# Altium schematic sheet Motor.SchDoc
size A4
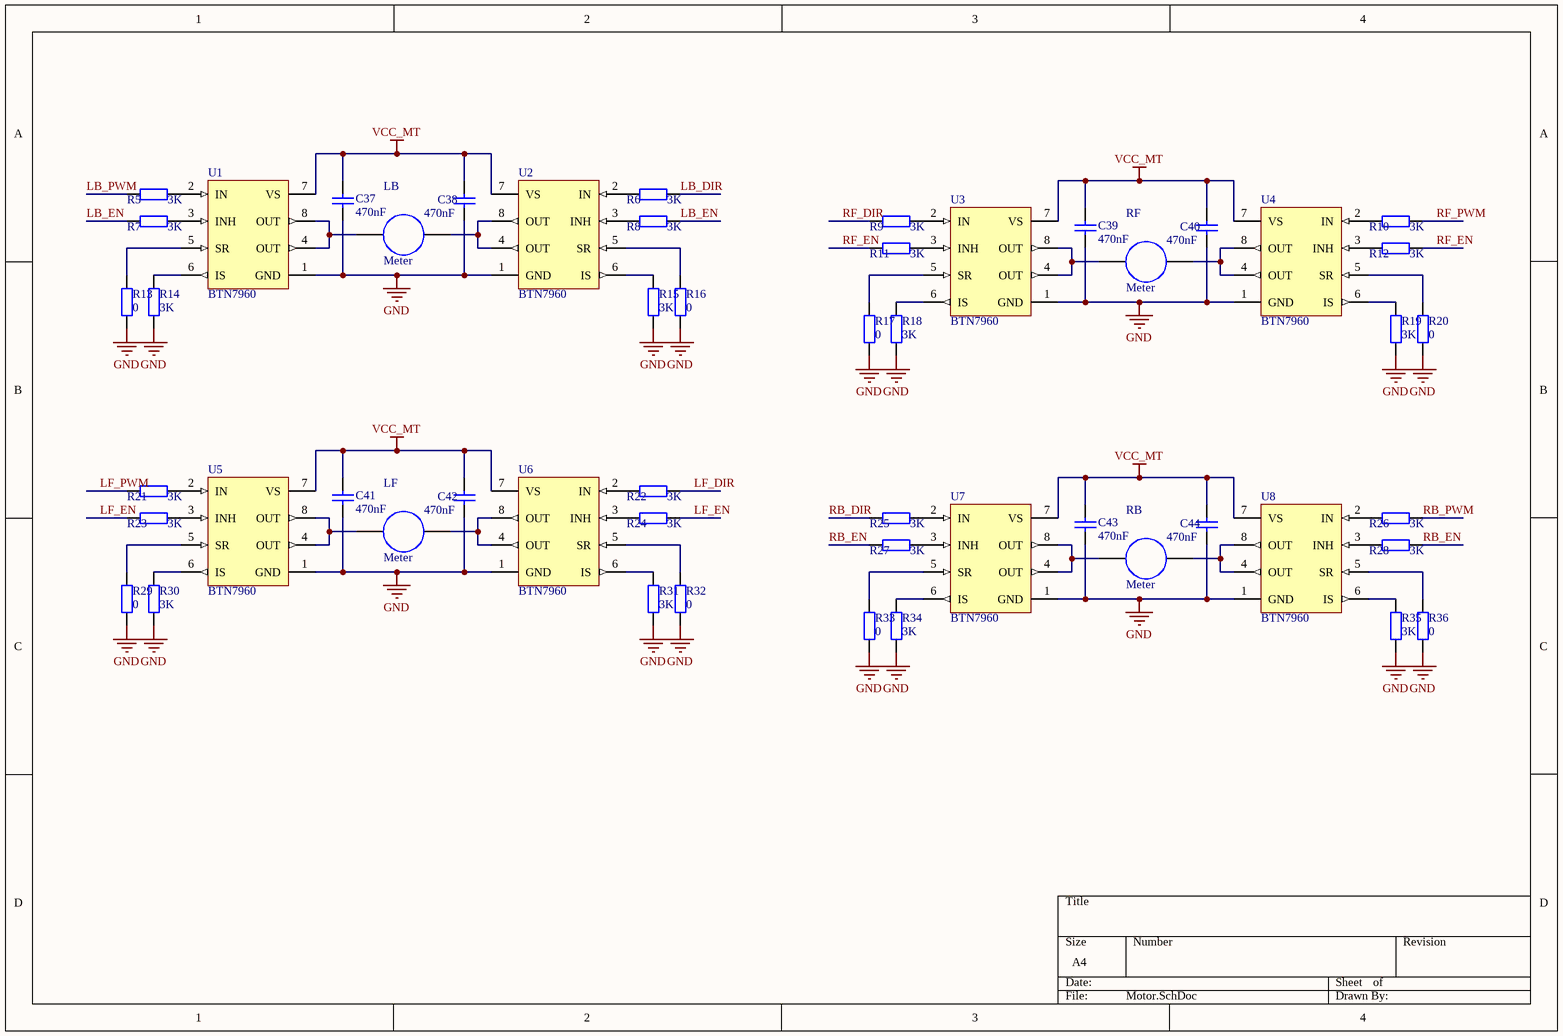
[diagram p0: Motor.SchDoc]

## Parts
C37  value 470nF  [0805_C]  (hidden comment: Cap)
C38  value 470nF  [0805_C]  (hidden comment: Cap)
C39  value 470nF  [0805_C]  (hidden comment: Cap)
C40  value 470nF  [0805_C]  (hidden comment: Cap)
C41  value 470nF  [0805_C]  (hidden comment: Cap)
C42  value 470nF  [0805_C]  (hidden comment: Cap)
C43  value 470nF  [0805_C]  (hidden comment: Cap)
C44  value 470nF  [0805_C]  (hidden comment: Cap)
LB  Meter  [Head_Small]
LF  Meter  [Head_Small]
R5  value 3K  [0805_R]  (hidden comment: Res2)
R6  value 3K  [0805_R]  (hidden comment: Res2)
R7  value 3K  [0805_R]  (hidden comment: Res2)
R8  value 3K  [0805_R]  (hidden comment: Res2)
R9  value 3K  [0805_R]  (hidden comment: Res2)
R10  value 3K  [0805_R]  (hidden comment: Res2)
R11  value 3K  [0805_R]  (hidden comment: Res2)
R12  value 3K  [0805_R]  (hidden comment: Res2)
R13  value 0  [0805_R]  (hidden comment: Res2)
R14  value 3K  [0805_R]  (hidden comment: Res2)
R15  value 3K  [0805_R]  (hidden comment: Res2)
R16  value 0  [0805_R]  (hidden comment: Res2)
R17  value 0  [0805_R]  (hidden comment: Res2)
R18  value 3K  [0805_R]  (hidden comment: Res2)
R19  value 3K  [0805_R]  (hidden comment: Res2)
R20  value 0  [0805_R]  (hidden comment: Res2)
R21  value 3K  [0805_R]  (hidden comment: Res2)
R22  value 3K  [0805_R]  (hidden comment: Res2)
R23  value 3K  [0805_R]  (hidden comment: Res2)
R24  value 3K  [0805_R]  (hidden comment: Res2)
R25  value 3K  [0805_R]  (hidden comment: Res2)
R26  value 3K  [0805_R]  (hidden comment: Res2)
R27  value 3K  [0805_R]  (hidden comment: Res2)
R28  value 3K  [0805_R]  (hidden comment: Res2)
R29  value 0  [0805_R]  (hidden comment: Res2)
R30  value 3K  [0805_R]  (hidden comment: Res2)
R31  value 3K  [0805_R]  (hidden comment: Res2)
R32  value 0  [0805_R]  (hidden comment: Res2)
R33  value 0  [0805_R]  (hidden comment: Res2)
R34  value 3K  [0805_R]  (hidden comment: Res2)
R35  value 3K  [0805_R]  (hidden comment: Res2)
R36  value 0  [0805_R]  (hidden comment: Res2)
RB  Meter  [Head_Small]
RF  Meter  [Head_Small]
U1  BTN7960  [TO-263-7]
U2  BTN7960  [TO-263-7]
U3  BTN7960  [TO-263-7]
U4  BTN7960  [TO-263-7]
U5  BTN7960  [TO-263-7]
U6  BTN7960  [TO-263-7]
U7  BTN7960  [TO-263-7]
U8  BTN7960  [TO-263-7]

## Nets
GND: C37.1 C38.2 C39.1 C40.2 C41.1 C42.2 C43.1 C44.2 R13.1 R14.1 R15.1 R16.1 R17.1 R18.1 R19.1 R20.1 R29.1 R30.1 R31.1 R32.1 R33.1 R34.1 R35.1 R36.1 U1.1(GND) U2.1(GND) U3.1(GND) U4.1(GND) U5.1(GND) U6.1(GND) U7.1(GND) U8.1(GND)
VCC_MT: C37.2 C38.1 C39.2 C40.1 C41.2 C42.1 C43.2 C44.1 U1.7(VS) U2.7(VS) U3.7(VS) U4.7(VS) U5.7(VS) U6.7(VS) U7.7(VS) U8.7(VS)
LB_DIR: R6.1
LB_EN: R7.1 R8.1
LB_PWM: R5.2
LF_DIR: R22.1
LF_EN: R23.1 R24.1
LF_PWM: R21.2
RB_DIR: R25.2
RB_EN: R27.1 R28.1
RB_PWM: R26.1
RF_DIR: R9.2
RF_EN: R11.1 R12.1
RF_PWM: R10.1
NetLB_1: LB.1 U1.4(OUT) U1.8(OUT)
NetLB_2: LB.2 U2.4(OUT) U2.8(OUT)
NetLF_1: LF.1 U5.4(OUT) U5.8(OUT)
NetLF_2: LF.2 U6.4(OUT) U6.8(OUT)
NetR5_1: R5.1 U1.2(IN)
NetR6_2: R6.2 U2.2(IN)
NetR7_2: R7.2 U1.3(INH)
NetR8_2: R8.2 U2.3(INH)
NetR9_1: R9.1 U3.2(IN)
NetR10_2: R10.2 U4.2(IN)
NetR11_2: R11.2 U3.3(INH)
NetR12_2: R12.2 U4.3(INH)
NetR13_2: R13.2 U1.5(SR)
NetR14_2: R14.2 U1.6(IS)
NetR15_2: R15.2 U2.6(IS)
NetR16_2: R16.2 U2.5(SR)
NetR17_2: R17.2 U3.5(SR)
NetR18_2: R18.2 U3.6(IS)
NetR19_2: R19.2 U4.6(IS)
NetR20_2: R20.2 U4.5(SR)
NetR21_1: R21.1 U5.2(IN)
NetR22_2: R22.2 U6.2(IN)
NetR23_2: R23.2 U5.3(INH)
NetR24_2: R24.2 U6.3(INH)
NetR25_1: R25.1 U7.2(IN)
NetR26_2: R26.2 U8.2(IN)
NetR27_2: R27.2 U7.3(INH)
NetR28_2: R28.2 U8.3(INH)
NetR29_2: R29.2 U5.5(SR)
NetR30_2: R30.2 U5.6(IS)
NetR31_2: R31.2 U6.6(IS)
NetR32_2: R32.2 U6.5(SR)
NetR33_2: R33.2 U7.5(SR)
NetR34_2: R34.2 U7.6(IS)
NetR35_2: R35.2 U8.6(IS)
NetR36_2: R36.2 U8.5(SR)
NetRB_1: RB.1 U7.4(OUT) U7.8(OUT)
NetRB_2: RB.2 U8.4(OUT) U8.8(OUT)
NetRF_1: RF.1 U3.4(OUT) U3.8(OUT)
NetRF_2: RF.2 U4.4(OUT) U4.8(OUT)

## Library data of the parts
C37-C44 = Cap: Capacitor; Published: 8-Jun-2000; LatestRevisionDate: 17-Jul-2002; LatestRevisionNote: Re-released for DXP Platform.; PackageReference: RAD-0.3; Publisher: Altium Limited
LB LF RB RF = Meter: Indicating Instrument; Note: Place a "letter" into the symbol to show the function of the meter or instrument; Published: 24-Mar-1999; LatestRevisionDate: 17-Jul-2002; LatestRevisionNote: Re-released for DXP Platform.; PackageReference: RAD-0.1; Publisher: Altium Limited
R5-R36 = Res2: Resistor; Published: 8-Jun-2000; LatestRevisionDate: 17-Jul-2002; LatestRevisionNote: Re-released for DXP Platform.; PackageReference: AXIAL-0.4; Publisher: Altium Limited